# EAGLE design purza (EAGLE 7.2.0)
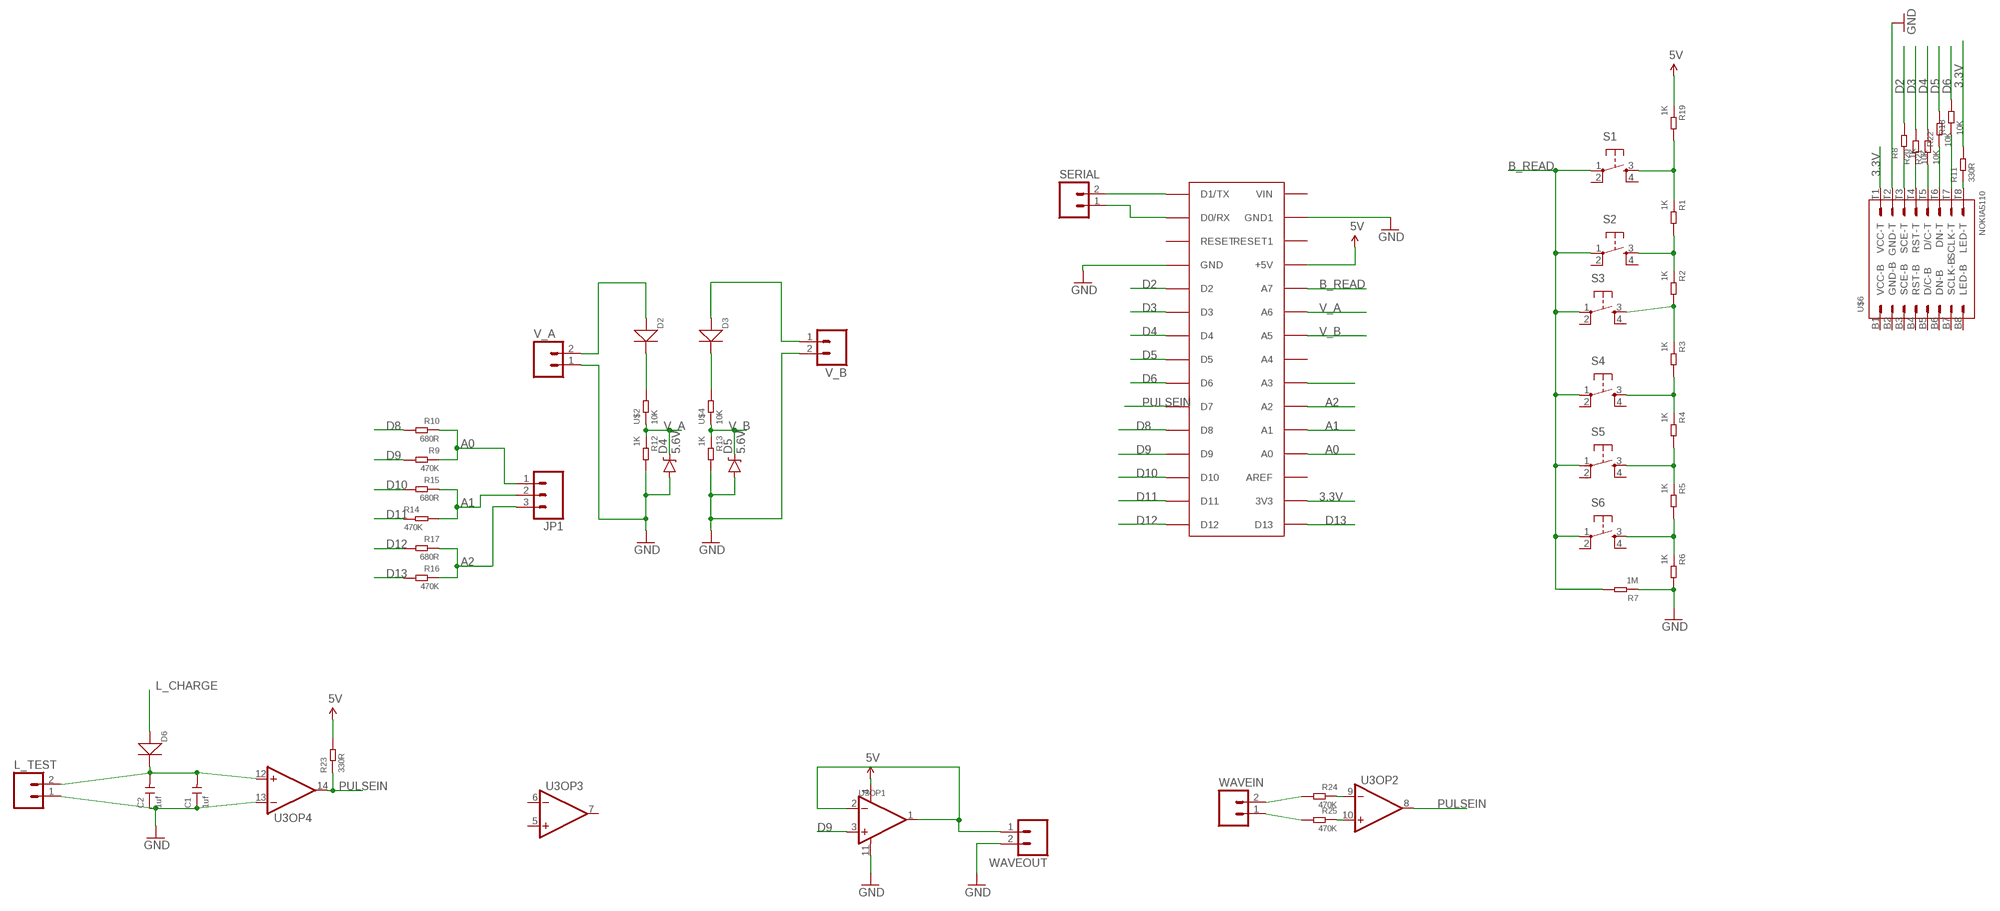
[diagram p0: schematic, sheet 1]

## Parts
C1  1uf  CERAMIC-1UF-25V-10%-X7R(0805)  [C0805]
C2  1uf  CERAMIC-1UF-25V-10%-X7R(0805)  [C0805]
D2  DIODE'1206'  [SOD-123]
D3  DIODE'1206'  [SOD-123]
D4  5.6V  DIODE-ZENER5.6V  [SOD-323]
D5  5.6V  DIODE-ZENER5.6V  [SOD-323]
D6  DIODE'1206'  [SOD-123]
JP1  M03LOCK  [1X03_LOCK]
L_TEST  M02LOCK  [1X02_LOCK]
R1  1K  SMD-RES-1K-1%-1/10W(0603)  [R0603]
R2  1K  SMD-RES-1K-1%-1/10W(0603)  [R0603]
R3  1K  SMD-RES-1K-1%-1/10W(0603)  [R0603]
R4  1K  SMD-RES-1K-1%-1/10W(0603)  [R0603]
R5  1K  SMD-RES-1K-1%-1/10W(0603)  [R0603]
R6  1K  SMD-RES-1K-1%-1/10W(0603)  [R0603]
R7  1M  SMD-RES-1M-1%-1/10W(0603)  [R0603]
R8  1K  SMD-RES-1K-1%-1/10W(0603)  [R0603]
R9  470K  SMD-RES-470K-1%-1/10W(0603)  [R0603]
R10  680R  SMD-RES-680R-1%-1/10W(0603)  [R0603]
R11  330R  SMD-RES-330R-1%-1/10W(0603)  [R0603]
R12  1K  SMD-RES-1K-1%-1/10W(0603)  [R0603]
R13  1K  SMD-RES-1K-1%-1/10W(0603)  [R0603]
R14  470K  SMD-RES-470K-1%-1/10W(0603)  [R0603]
R15  680R  SMD-RES-680R-1%-1/10W(0603)  [R0603]
R16  470K  SMD-RES-470K-1%-1/10W(0603)  [R0603]
R17  680R  SMD-RES-680R-1%-1/10W(0603)  [R0603]
R18  10K  SMD-RES-10K-1%-1/10W(0603)  [R0603]
R19  1K  SMD-RES-1K-1%-1/10W(0603)  [R0603]
R20  10K  SMD-RES-10K-1%-1/10W(0603)  [R0603]
R21  10K  SMD-RES-10K-1%-1/10W(0603)  [R0603]
R22  10K  SMD-RES-10K-1%-1/10W(0603)  [R0603]
R23  330R  SMD-RES-330R-1%-1/10W(0603)  [R0603]
R24  470K  SMD-RES-470K-1%-1/10W(0603)  [R0603]
R25  470K  SMD-RES-470K-1%-1/10W(0603)  [R0603]
S1  TAC_SWITCHPTH  [TACTILE-PTH]
S2  TAC_SWITCHPTH  [TACTILE-PTH]
S3  TAC_SWITCHPTH  [TACTILE-PTH]
S4  TAC_SWITCHPTH  [TACTILE-PTH]
S5  TAC_SWITCHPTH  [TACTILE-PTH]
S6  TAC_SWITCHPTH  [TACTILE-PTH]
SERIAL  M02LOCK  [1X02_LOCK]
U3  AMPLIFIER-LMV324IDR(SOIC14)  [SOIC14-1.27-9.3X4.3MM]
U$1  ARDUINONANO  [PDIP-32]
U$2  10K  SMD-RES-10K-1%-1/8W(0805)  [R0805]
U$4  10K  SMD-RES-10K-1%-1/8W(0805)  [R0805]
U$6  NOKIA5110  [NOKIA5110]
V_A  M02LOCK  [1X02_LOCK]
V_B  M02LOCK  [1X02_LOCK]
WAVEIN  M02LOCK  [1X02_LOCK]
WAVEOUT  M02LOCK  [1X02_LOCK]

## Nets
3.3V: R11.2 U$1.3V3 U$6.T1(VCC-T)
5V: R19.1 R23.2 U3.4(OP1:V+) U$1.+5V
A0: JP1.1 R9.1 R10.1 U$1.A0
A1: JP1.2 R14.2 R15.1 U$1.A1
A2: JP1.3 R16.1 R17.1 U$1.A2
B_READ: R7.2 S1.1 S2.1 S3.1 S4.1 S5.1 S6.1 U$1.A7
D2: R8.2 U$1.D2
D3: R20.2 U$1.D3
D4: R21.2 U$1.D4
D5: R22.2 U$1.D5
D6: R18.2 U$1.D6
D8: R10.2 U$1.D8
D9: R9.2 U3.3(OP1:IN+) U$1.D9
D10: R15.2 U$1.D10
D11: R14.1 U$1.D11
D12: R17.2 U$1.D12
D13: R16.2 U$1.D13
GND: C1.1 C2.1 D4.A D5.A L_TEST.1 R6.2 R7.1 R12.2 R13.2 U3.11(OP1:V-) U3.13(OP4:IN-) U$1.GND U$1.GND1 U$6.T2(GND-T) V_A.1 V_B.2 WAVEOUT.2
L_CHARGE: D6.+ U$1.A3
N$1: D2.- U$2.2
N$2: D3.- U$4.2
N$3: R20.1 U$6.T4(RST-T)
N$4: R21.1 U$6.T5(D/C-T)
N$5: R22.1 U$6.T6(DN-T)
N$6: R18.1 U$6.T7(SCLK-T)
N$7: R11.1 U$6.T8(LED-T)
N$8: R8.1 U$6.T3(SCE-T)
N$9: D3.+ V_B.1
N$10: R1.2 R2.1 S2.3
N$11: R2.2 R3.1 S3.3
N$12: R3.2 R4.1 S4.3
N$13: R4.2 R5.1 S5.3
N$14: SERIAL.2 U$1.D1/TX
N$15: SERIAL.1 U$1.D0/RX
N$16: R1.1 R19.2 S1.3
N$17: D2.+ V_A.2
N$18: U3.1(OP1:OUT) U3.2(OP1:IN-) WAVEOUT.1
N$19: C1.2 C2.2 D6.- L_TEST.2 U3.12(OP4:IN+)
N$20: R24.2 WAVEIN.2
N$21: R25.2 WAVEIN.1
N$22: R25.1 U3.10(OP2:IN+)
N$23: R24.1 U3.9(OP2:IN-)
N$24: R5.2 R6.1 S6.3
PULSEIN: R23.1 U3.8(OP2:OUT) U3.14(OP4:OUT) U$1.D7
V_A: D4.C R12.1 U$1.A6 U$2.1
V_B: D5.C R13.1 U$1.A5 U$4.1
Unconnected: S1.2 S1.4 S2.2 S2.4 S3.2 S3.4 S4.2 S4.4 S5.2 S5.4 S6.2 S6.4 U3.5(OP3:IN+) U3.6(OP3:IN-) U3.7(OP3:OUT) U$1.A4 U$1.AREF U$1.RESET U$1.RESET1 U$1.VIN U$6.B1(VCC-B) U$6.B2(GND-B) U$6.B3(SCE-B) U$6.B4(RST-B) U$6.B5(D/C-B) U$6.B6(DN-B) U$6.B7(SCLK-B) U$6.B8(LED-B)

## Library data of the parts
C1 C2 = Seeed-OPL-Capacitor:CERAMIC-1UF-25V-10%-X7R(0805): 302010179; MPN: CC0805KKX7R8BB105
D2 D3 D6 = Seeed-OPL-Diode:DIODE*
D4 D5 = SparkFun-DiscreteSemi:DIODE-ZENER: Zener Diode Production Part - 8199 3.4V Zener Voltage; PROD_ID: DIO-12442
JP1 = SparkFun-Connectors:M03: Header 3 Standard 3-pin 0.1" header. Use with straight break away headers (SKU : PRT-00116), right angle break away headers (PRT-00553), swiss pins (PRT-00743), machine pins (PRT-00117), and female headers (PRT-00115). Molex polarized connector foot print use with SKU : PRT-08232 with associated crimp pins and housings.
L_TEST SERIAL V_A V_B WAVEIN WAVEOUT = SparkFun-Connectors:M02: Standard 2-pin 0.1" header. Use with - straight break away headers ( PRT-00116) - right angle break away headers (PRT-00553) - swiss pins (PRT-00743) - machine pins (PRT-00117) - female headers (PRT-00115) Molex polarized connector foot print use with: PRT-08233 with associated crimp pins and housings. 2.54_SCREWTERM for use with PRT-10571. 3.5mm Screw Terminal footprints for PRT-08084 5mm Screw Terminal footprints for use with PRT-08432
R1-R6 R8 R12 R13 R19 = Seeed-OPL-Resistor:SMD-RES-1K-1%-1/10W(0603): 301010298; MPN: RC0603FR-071KL
R7 = Seeed-OPL-Resistor:SMD-RES-1M-1%-1/10W(0603): 301010151; MPN: RC0603FR-071ML
R9 R14 R16 R24 R25 = Seeed-OPL-Resistor:SMD-RES-470K-1%-1/10W(0603): 301010190; MPN: RC0603FR-07470KL
R10 R15 R17 = Seeed-OPL-Resistor:SMD-RES-680R-1%-1/10W(0603): 301010260; MPN: RC0603FR-07680RL
R11 R23 = Seeed-OPL-Resistor:SMD-RES-330R-1%-1/10W(0603): 301010300; MPN: RC0603FR-07330RL
R18 R20-R22 = Seeed-OPL-Resistor:SMD-RES-10K-1%-1/10W(0603): 301010299; MPN: RC0603FR-0710KL
S1-S6 = SparkFun-Retired:TAC_SWITCH: Momentary Switch Button commonly used for reset or general input. Spark Fun Electronics SKU : COM-00097 SMT- SWCH-08247
U3 = Seeed-OPL-IC:AMPLIFIER-LMV324IDR(SOIC14): 310020019; MPN: LMV324IDR
U$1 = jet-lib:ARDUINONANO
U$2 U$4 = Seeed-OPL-Resistor:SMD-RES-10K-1%-1/8W(0805): 301010361; MPN: RC0805FR-0710KL
U$6 = display:NOKIA5110

## Board
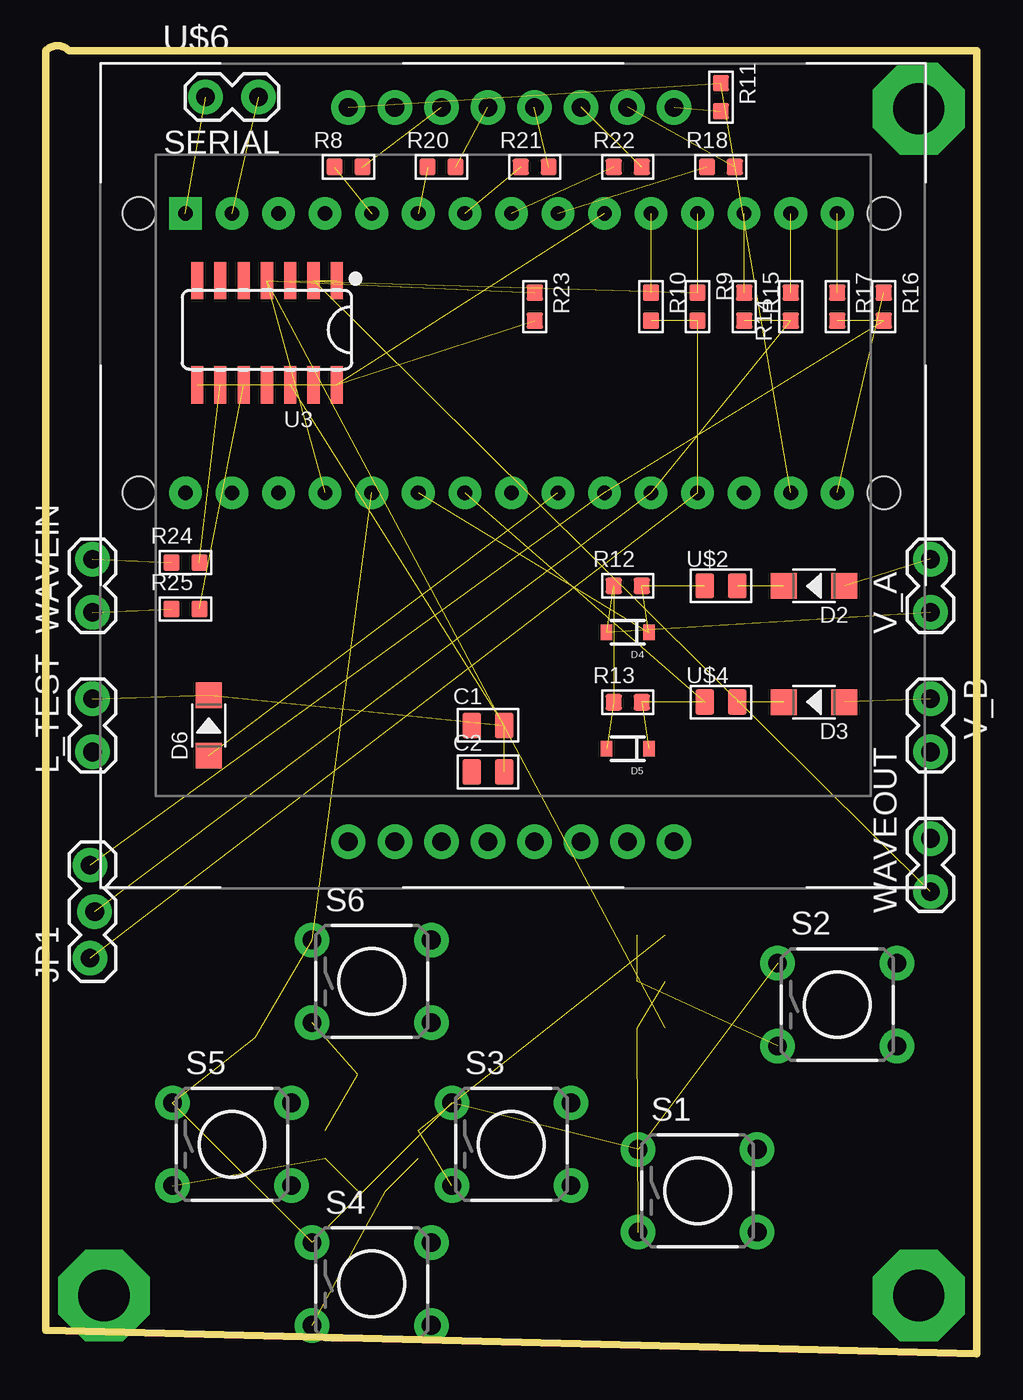
[diagram p1: board, top side]
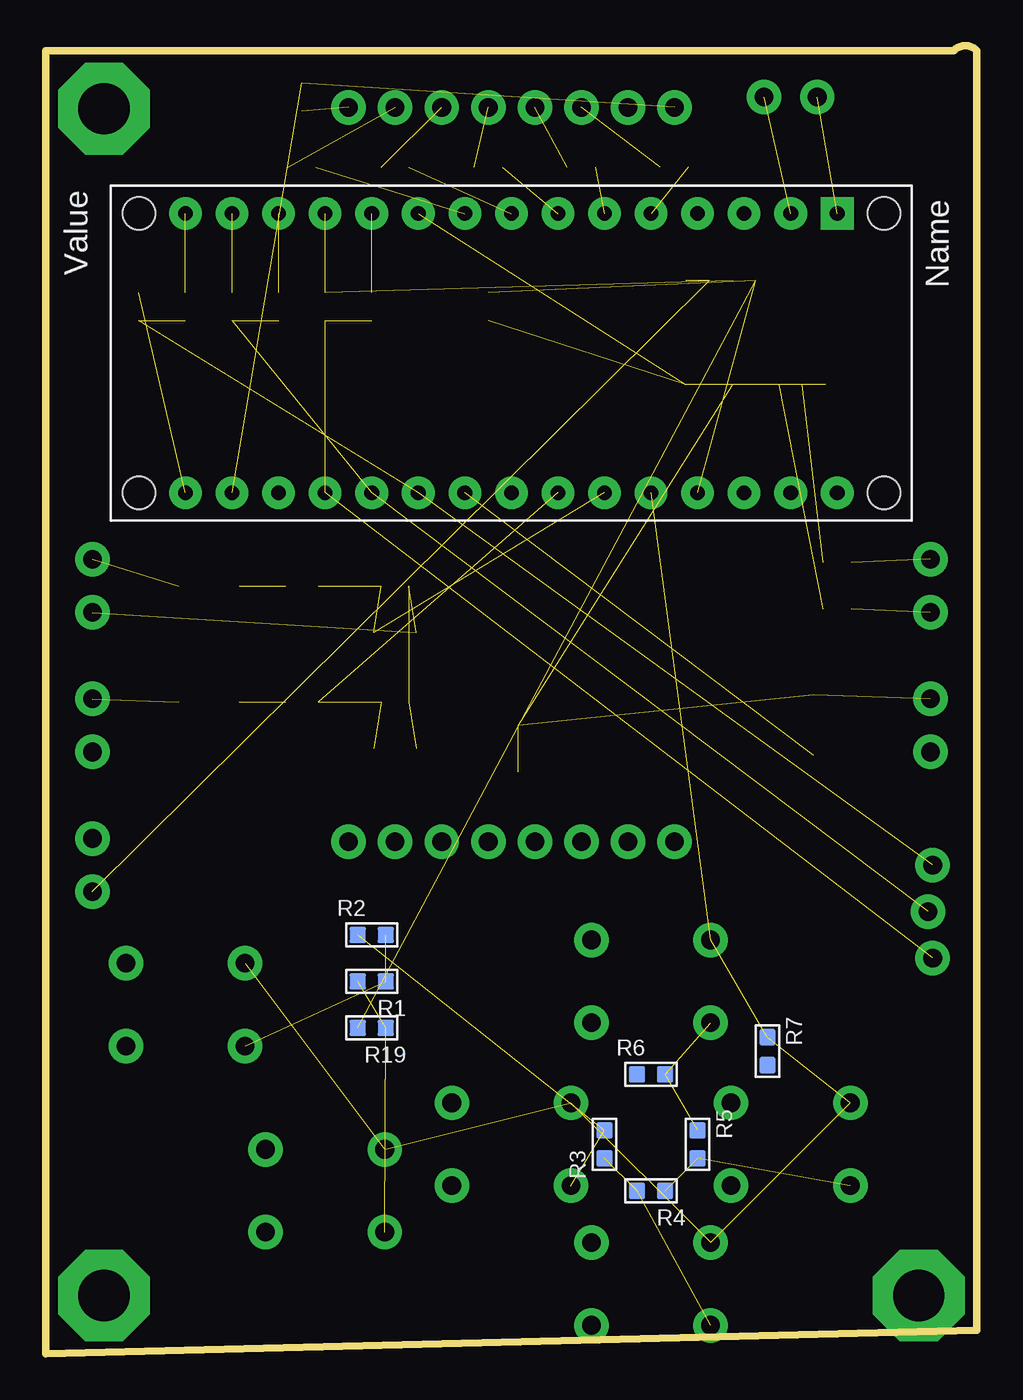
[diagram p2: board, bottom side, seen from below]

Size 50.8 x 71.38 mm. Coordinates in mm from the lower left corner, seen from the top.
Outline: 50.8,71.12 1.27,71.12 arc90 0,71.12 0,1.27 50.8,0 50.8,71.12
Copper layers (1*16): Top 0.035mm / dielectric 1.5mm / Bottom 0.035mm
Design rules "default": minimum track width 10mil, minimum drill 24mil, track to track 8mil, track to pad 8mil, pad to pad 8mil, via to via 8mil, smd to smd 8mil, copper to edge 40mil, drill to drill 8mil, minimum pad ring 10mil, minimum via ring 8mil, stop-mask expansion 4mil, vias tented up to drill 0mil, thermal gap 10mil

### Footprints (pad centres in the part's own frame; a part is rotated, then mirrored left to right if it is on the bottom)
C0805 = smd 1.397 x 1.016: 1 0,0.889; 2 0,-0.889
SOD-123 = smd 1.397 x 1.397: + -1.651,0; - 1.651,0
SOD-323 = smd 0.63 x 0.83: A 1.15,0; C -1.15,0
1X03_LOCK = drill 1.016 pad 1.88: 1 0,0.127; 2 2.54,-0.127; 3 5.08,0.127
1X02_LOCK = drill 1.016 pad 1.88: 1 -0.178,0; 2 2.718,0
R0603 = smd 0.889 x 0.889: 1 0,0.762; 2 0,-0.762
TACTILE-PTH = drill 1.016 pad 1.88: 1 -3.251,2.261; 2 3.251,2.261; 3 -3.251,-2.261; 4 3.251,-2.261
SOIC14-1.27-9.3X4.3MM = smd 0.66 x 2.032: 1 -3.175,-2.68; 2 -1.905,-2.68; 3 -0.635,-2.68; 4 0.635,-2.68; 5 1.905,-2.68; 6 3.175,-2.68; 7 4.445,-2.68; 8 4.445,2.997; 9 3.175,2.997; 10 1.905,2.997; 11 0.635,2.997; 12 -0.635,2.997; 13 -1.905,2.997; 14 -3.175,2.997
PDIP-32 = drill 0.8 pad 1.778: 3V3 15.24,-35.56; +5V 15.24,-10.16; A0 15.24,-30.48; A1 15.24,-27.94; A2 15.24,-25.4; A3 15.24,-22.86; A4 15.24,-20.32; A5 15.24,-17.78; A6 15.24,-15.24; A7 15.24,-12.7; AREF 15.24,-33.02; D0/RX 0,-5.08; D2 0,-12.7; D3 0,-15.24; D4 0,-17.78; D5 0,-20.32; D6 0,-22.86; D7 0,-25.4; D8 0,-27.94; D9 0,-30.48; D10 0,-33.02; D11 0,-35.56; D12 0,-38.1; D13 15.24,-38.1; GND 0,-10.16; GND1 15.24,-5.08; RESET 0,-7.62; RESET1 15.24,-7.62; VIN 15.24,-2.54 | drill 0.8 pad 1.778 square: D1/TX 0,-2.54 | hole 1.778: 0,0; 0,-40.64; 15.24,-40.64; 15.24,0
R0805 = smd 1.397 x 1.016: 1 0,0.889; 2 0,-0.889
NOKIA5110 = drill 1.016 pad 1.88: B1 -0.01,0; B2 2.53,0; B3 5.07,0; B4 7.61,0; B5 10.15,0; B6 12.69,0; B7 15.23,0; B8 17.77,0; T1 -0.01,40.08; T2 2.53,40.08; T3 5.07,40.08; T4 7.61,40.08; T5 10.15,40.08; T6 12.69,40.08; T7 15.23,40.08; T8 17.77,40.08

### Placement (x,y rotation side)
C1  24.13,34.29 90 top
C2  24.13,31.75 90 top
D2  41.91,41.91 180 top
D3  41.91,35.56 180 top
D4  31.75,39.37 180 top
D5  31.75,33.02 180 top
D6  8.89,34.29 90 top
JP1  2.54,21.59 90 top
L_TEST  2.54,33.02 90 top
R1  33.02,20.32 90 bottom
R2  33.02,22.86 270 bottom
R3  20.32,11.43 0 bottom
R4  17.78,8.89 90 bottom
R5  15.24,11.43 180 bottom
R6  17.78,15.24 270 bottom
R7  11.43,16.51 180 bottom
R8  16.51,64.77 270 top
R9  35.56,57.15 180 top
R10  33.02,57.15 180 top
R11  36.83,68.58 180 top
R12  31.75,41.91 270 top
R13  31.75,35.56 270 top
R14  40.64,57.15 0 top
R15  38.1,57.15 180 top
R16  45.72,57.15 180 top
R17  43.18,57.15 180 top
R18  36.83,64.77 270 top
R19  33.02,17.78 90 bottom
R20  21.59,64.77 270 top
R21  26.67,64.77 270 top
R22  31.75,64.77 270 top
R23  26.67,57.15 180 top
R24  7.62,43.18 270 top
R25  7.62,40.64 270 top
S1  35.56,8.89 0 top
S2  43.18,19.05 0 top
S3  25.4,11.43 0 top
S4  17.78,3.81 0 top
S5  10.16,11.43 0 top
S6  17.78,20.32 0 top
SERIAL  11.43,68.58 180 top
U3  12.7,55.88 180 top
U$1  5.08,62.23 270 bottom
U$2  36.83,41.91 90 top
U$4  36.83,35.56 90 top
U$6  16.51,27.94 0 top
V_A  48.26,40.64 90 top
V_B  48.26,35.56 270 top
WAVEIN  2.54,40.64 90 top
WAVEOUT  48.26,25.4 90 top

### Tracks (layer width: path | path; a pad name or v marks a point on that pad's centre or on a via)
3.3V  (2 unrouted)
5V  (3 unrouted)
A0  (3 unrouted)
A1  (3 unrouted)
A2  (3 unrouted)
B_READ  (7 unrouted)
D2  (1 unrouted)
D3  (1 unrouted)
D4  (1 unrouted)
D5  (1 unrouted)
D6  (1 unrouted)
D8  (1 unrouted)
D9  (2 unrouted)
D10  (1 unrouted)
D11  (1 unrouted)
D12  (1 unrouted)
D13  (1 unrouted)
GND  (4 unrouted)
L_CHARGE  (1 unrouted)
N$1  (1 unrouted)
N$2  (1 unrouted)
N$3  (1 unrouted)
N$4  (1 unrouted)
N$5  (1 unrouted)
N$6  (1 unrouted)
N$7  (1 unrouted)
N$8  (1 unrouted)
N$9  (1 unrouted)
N$10  (2 unrouted)
N$11  (2 unrouted)
N$12  (2 unrouted)
N$13  (2 unrouted)
N$14  (1 unrouted)
N$15  (1 unrouted)
N$16  (2 unrouted)
N$17  (1 unrouted)
N$18  (2 unrouted)
N$19  (4 unrouted)
N$20  (1 unrouted)
N$21  (1 unrouted)
N$22  (1 unrouted)
N$23  (1 unrouted)
N$24  (2 unrouted)
N$26  (via drill 2.8 pad 5)
  other vias: 47.62,67.94
N$27  (via drill 2.8 pad 5)
  other vias: 3.17,3.18
N$28  (via drill 2.8 pad 5)
  other vias: 47.62,3.18
PULSEIN  (3 unrouted)
V_A  (3 unrouted)
V_B  (3 unrouted)